# Altium schematic sheet ATMega.SchDoc
size A4
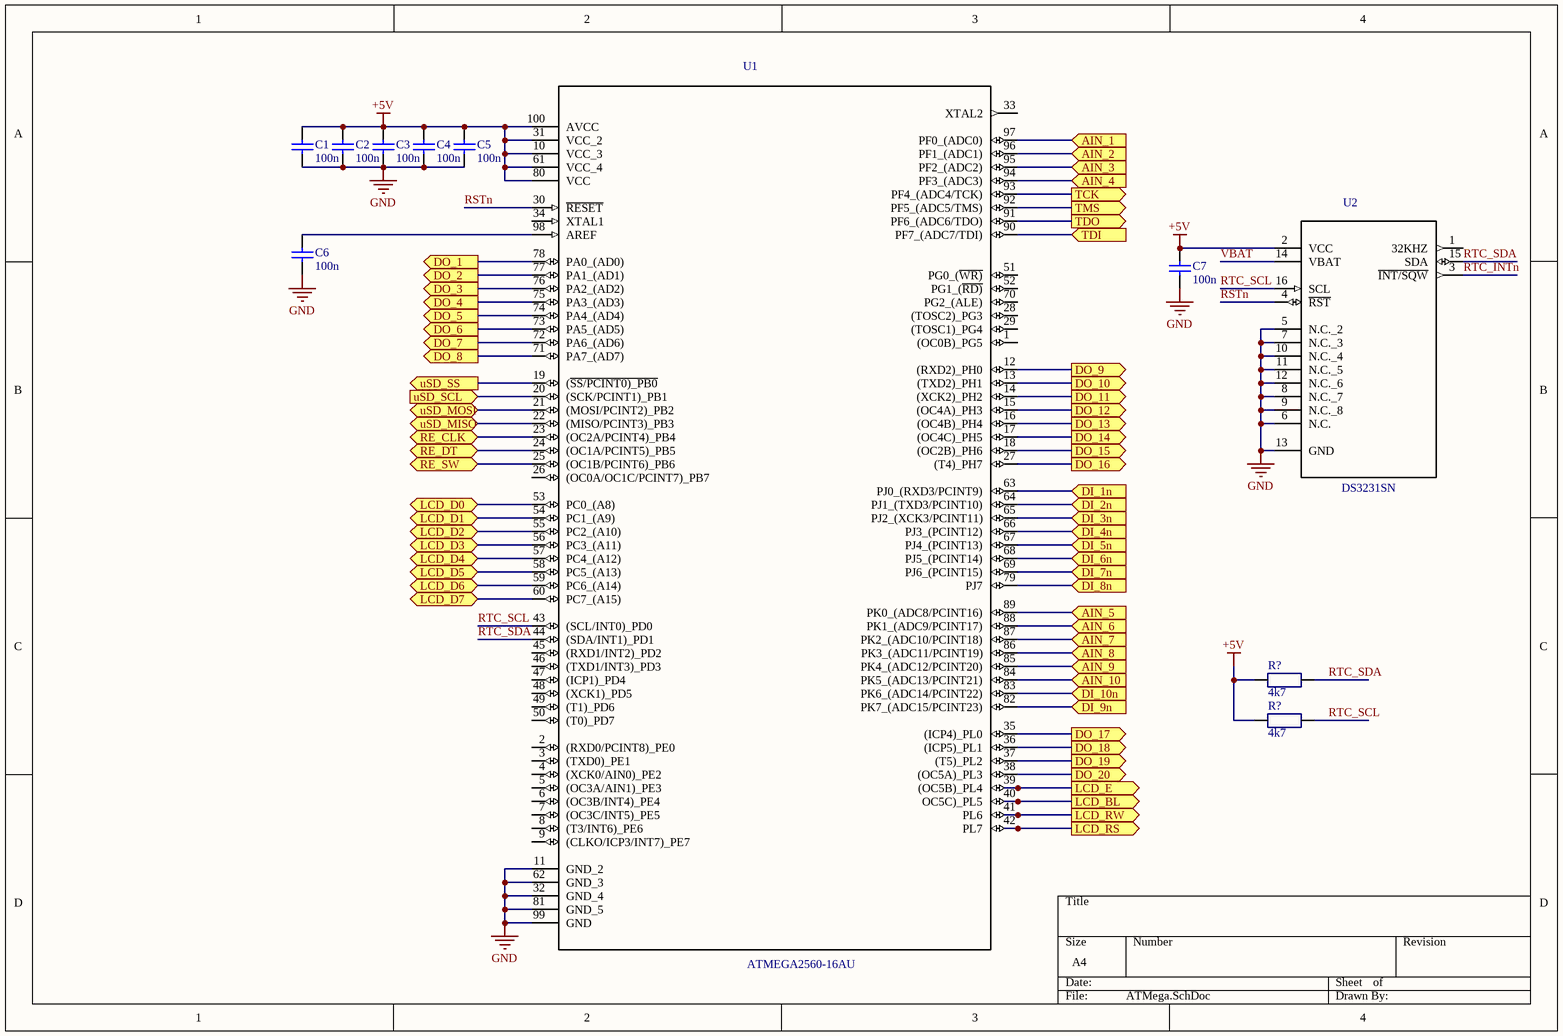
[diagram p0: ATMega.SchDoc]

## Parts
(Parts that share a designator on the sheet are numbered #1, #2 ... from top to bottom, then left to right.)
C1  value 100n  [CAP_0402]  (hidden comment: 0402)
C2  value 100n  [CAP_0402]  (hidden comment: 0402)
C3  value 100n  [CAP_0402]  (hidden comment: 0402)
C4  value 100n  [CAP_0402]  (hidden comment: 0402)
C5  value 100n  [CAP_0402]  (hidden comment: 0402)
C6  value 100n  [CAP_0402]  (hidden comment: 0402)
C7  value 100n  [CAP_0402]  (hidden comment: 0402)
R?#1  value 4k7  [RES_0402]  (hidden comment: RES_0402)
R?#2  value 4k7  [RES_0402]  (hidden comment: RES_0402)
U1  ATMEGA2560-16AU  [QFP50P1600X1600X120-100N]
U2  DS3231SN  [SOIC127P1032X265-16N]

## Ports
AIN_1 (in), AIN_2 (in), AIN_3 (in), AIN_4 (in), AIN_5 (in), AIN_6 (in), AIN_7 (in), AIN_8 (in), AIN_9 (in), AIN_10 (in), DI_1n (in), DI_2n (in), DI_3n (in), DI_4n (in), DI_5n (in), DI_6n (in), DI_7n (in), DI_8n (in), DI_9n (in), DI_10n (in), DO_1 (out), DO_2 (out), DO_3 (out), DO_4 (out), DO_5 (out), DO_6 (out), DO_7 (out), DO_8 (out), DO_9 (out), DO_10 (out), DO_11 (out), DO_12 (out), DO_13 (out), DO_14 (out), DO_15 (out), DO_16 (out), DO_17 (out), DO_18 (out), DO_19 (out), DO_20 (out), LCD_BL (out), LCD_D0 (bidir), LCD_D1 (bidir), LCD_D2 (bidir), LCD_D3 (bidir), LCD_D4 (bidir), LCD_D5 (bidir), LCD_D6 (bidir), LCD_D7 (bidir), LCD_E (out), LCD_RS (out), LCD_RW (out), RE_CLK (bidir), RE_DT (bidir), RE_SW (bidir), TCK (out), TDI (in), TDO (out), TMS (out), uSD_MISO (bidir), uSD_MOSI (bidir), uSD_SCL (in), uSD_SS (out)

## Nets
+5V: C1.2 C2.2 C3.2 C4.2 C5.2 C7.2 R?#1.1 R?#2.1 U1.10(VCC_3) U1.31(VCC_2) U1.61(VCC_4) U1.80(VCC) U1.100(AVCC) U2.2(VCC)
GND: C1.1 C2.1 C3.1 C4.1 C5.1 C6.1 C7.1 U1.11(GND_2) U1.32(GND_4) U1.62(GND_3) U1.81(GND_5) U1.99(GND) U2.5(N.C._2) U2.6(N.C.) U2.7(N.C._3) U2.8(N.C._7) U2.9(N.C._8) U2.10(N.C._4) U2.11(N.C._5) U2.12(N.C._6) U2.13(GND)
AIN_1: U1.97(PF0_(ADC0)) ; port AIN_1
AIN_2: U1.96(PF1_(ADC1)) ; port AIN_2
AIN_3: U1.95(PF2_(ADC2)) ; port AIN_3
AIN_4: U1.94(PF3_(ADC3)) ; port AIN_4
AIN_5: U1.89(PK0_(ADC8/PCINT16)) ; port AIN_5
AIN_6: U1.88(PK1_(ADC9/PCINT17)) ; port AIN_6
AIN_7: U1.87(PK2_(ADC10/PCINT18)) ; port AIN_7
AIN_8: U1.86(PK3_(ADC11/PCINT19)) ; port AIN_8
AIN_9: U1.85(PK4_(ADC12/PCINT20)) ; port AIN_9
AIN_10: U1.84(PK5_(ADC13/PCINT21)) ; port AIN_10
DI_1n: U1.63(PJ0_(RXD3/PCINT9)) ; port DI_1n
DI_2n: U1.64(PJ1_(TXD3/PCINT10)) ; port DI_2n
DI_3n: U1.65(PJ2_(XCK3/PCINT11)) ; port DI_3n
DI_4n: U1.66(PJ3_(PCINT12)) ; port DI_4n
DI_5n: U1.67(PJ4_(PCINT13)) ; port DI_5n
DI_6n: U1.68(PJ5_(PCINT14)) ; port DI_6n
DI_7n: U1.69(PJ6_(PCINT15)) ; port DI_7n
DI_8n: U1.79(PJ7) ; port DI_8n
DI_9n: U1.82(PK7_(ADC15/PCINT23)) ; port DI_9n
DI_10n: U1.83(PK6_(ADC14/PCINT22)) ; port DI_10n
DO_1: U1.78(PA0_(AD0)) ; port DO_1
DO_2: U1.77(PA1_(AD1)) ; port DO_2
DO_3: U1.76(PA2_(AD2)) ; port DO_3
DO_4: U1.75(PA3_(AD3)) ; port DO_4
DO_5: U1.74(PA4_(AD4)) ; port DO_5
DO_6: U1.73(PA5_(AD5)) ; port DO_6
DO_7: U1.72(PA6_(AD6)) ; port DO_7
DO_8: U1.71(PA7_(AD7)) ; port DO_8
DO_9: U1.12((RXD2)_PH0) ; port DO_9
DO_10: U1.13((TXD2)_PH1) ; port DO_10
DO_11: U1.14((XCK2)_PH2) ; port DO_11
DO_12: U1.15((OC4A)_PH3) ; port DO_12
DO_13: U1.16((OC4B)_PH4) ; port DO_13
DO_14: U1.17((OC4C)_PH5) ; port DO_14
DO_15: U1.18((OC2B)_PH6) ; port DO_15
DO_16: U1.27((T4)_PH7) ; port DO_16
DO_17: U1.35((ICP4)_PL0) ; port DO_17
DO_18: U1.36((ICP5)_PL1) ; port DO_18
DO_19: U1.37((T5)_PL2) ; port DO_19
DO_20: U1.38((OC5A)_PL3) ; port DO_20
LCD_BL: U1.40(OC5C)_PL5) ; port LCD_BL
LCD_D0: U1.53(PC0_(A8)) ; port LCD_D0
LCD_D1: U1.54(PC1_(A9)) ; port LCD_D1
LCD_D2: U1.55(PC2_(A10)) ; port LCD_D2
LCD_D3: U1.56(PC3_(A11)) ; port LCD_D3
LCD_D4: U1.57(PC4_(A12)) ; port LCD_D4
LCD_D5: U1.58(PC5_(A13)) ; port LCD_D5
LCD_D6: U1.59(PC6_(A14)) ; port LCD_D6
LCD_D7: U1.60(PC7_(A15)) ; port LCD_D7
LCD_E: U1.39((OC5B)_PL4) ; port LCD_E
LCD_RS: U1.42(PL7) ; port LCD_RS
LCD_RW: U1.41(PL6) ; port LCD_RW
RE_CLK: U1.23((OC2A/PCINT4)_PB4) ; port RE_CLK
RE_DT: U1.24((OC1A/PCINT5)_PB5) ; port RE_DT
RE_SW: U1.25((OC1B/PCINT6)_PB6) ; port RE_SW
RSTn: U1.30(~{RESET}) U2.4(~{RST})
RTC_INTn: U2.3(~{INT/SQW})
RTC_SCL: R?#2.2 U1.43((SCL/INT0)_PD0) U2.16(SCL)
RTC_SDA: R?#1.2 U1.44((SDA/INT1)_PD1) U2.15(SDA)
TCK: U1.93(PF4_(ADC4/TCK)) ; port TCK
TDI: U1.90(PF7_(ADC7/TDI)) ; port TDI
TDO: U1.91(PF6_(ADC6/TDO)) ; port TDO
TMS: U1.92(PF5_(ADC5/TMS)) ; port TMS
uSD_MISO: U1.22((MISO/PCINT3)_PB3) ; port uSD_MISO
uSD_MOSI: U1.21((MOSI/PCINT2)_PB2) ; port uSD_MOSI
uSD_SCL: U1.20((SCK/PCINT1)_PB1) ; port uSD_SCL
uSD_SS: U1.19((~{SS/PCINT0)_PB0}) ; port uSD_SS
VBAT: U2.14(VBAT)
NetC6_2: C6.2 U1.98(AREF)

Not connected (* = marked no-connect by the designer): U1 1((OC0B)_PG5) 2((RXD0/PCINT8)_PE0) 3((TXD0)_PE1) 4((XCK0/AIN0)_PE2) 5((OC3A/AIN1)_PE3) 6((OC3B/INT4)_PE4) 7((OC3C/INT5)_PE5) 8((T3/INT6)_PE6) 9((CLKO/ICP3/INT7)_PE7) 26((OC0A/OC1C/PCINT7)_PB7) 28((TOSC2)_PG3) 29((TOSC1)_PG4) 33(XTAL2) 34(XTAL1) 45((RXD1/INT2)_PD2) 46((TXD1/INT3)_PD3) 47((ICP1)_PD4) 48((XCK1)_PD5) 49((T1)_PD6) 50((T0)_PD7) 51(PG0_(~{WR)}) 52(PG1_(~{RD)}) 70(PG2_(ALE)); U2 1(32KHZ)

## Library data of the parts
C1-C7 = CAP_0402: Ceramic chip capacitor; SIGN: HL; Package: 0402; PartDescription: Chip capacitor; Component Class: A; Tolerance: ?
R?#1 R?#2 = RES_0402: SMD Chip Resistor 0402; SIGN: HL; PartDescription: Chip resistor; Package: 0402; Component Class: A; Operating Temperature: *; Tolerance: *
U1 = ATMEGA2560-16AU: Embedded microcontroller ATMEGA2560-16AU TQFP 100 _14x14_ Microchip Technology 8-Bit 16 MHz I/O number 86; SnapEDA_Link: https://www.snapeda.com/parts/ATMEGA2560-16AU/Microchip/view-part/?ref=snap; MF: Microchip; Price: None; Availability: Unavailable; MP: ATMEGA2560-16AU; Package: TQFP-100 Microchip; Value: *
U2 = DS3231SN: Real Time Clock Serial 16-Pin SOIC W; MF: Maxim Integrated; MP: DS3231SN#; Package: SOIC-16 Maxim Integrated; Price: None; SnapEDA_Link: https://www.snapeda.com/parts/DS3231SN%23/Maxim%20Integrated/view-part/?ref=snap; Availability: Unavailable; Value: *